# Altium schematic sheet Heater_conn.SchDoc
size A4; SheetNumber: 7; SheetTotal: 7
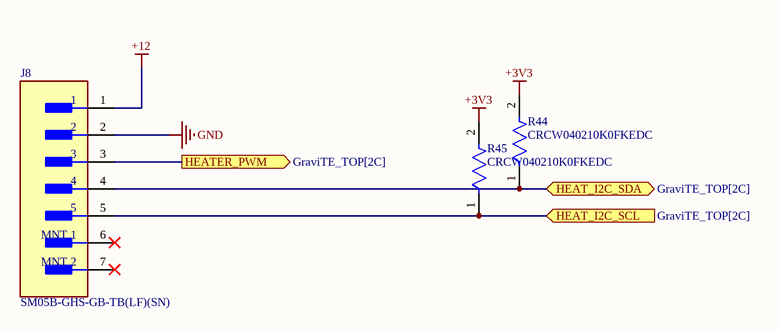
[diagram p0: Heater_conn.SchDoc]

## Parts
J8  SM05B-GHS-GB-TB(LF)(SN)  [FP-SM05B-GHS-GB-TB_LF_SN-MFG]
R44  CRCW040210K0FKEDC  [FP-CRCW0402-C-e3-IPC_C]
R45  CRCW040210K0FKEDC  [FP-CRCW0402-C-e3-IPC_C]

## Ports
HEAT_I2C_SCL (in, see GraviTE_TOP[2C]), HEAT_I2C_SDA (bidir, see GraviTE_TOP[2C]), HEATER_PWM (out, see GraviTE_TOP[2C])

## Nets
+3V3: R44.2 R45.2
+12: J8.1
GND: J8.2
HEAT_I2C_SCL: J8.5 R45.1 ; port HEAT_I2C_SCL
HEAT_I2C_SDA: J8.4 R44.1 ; port HEAT_I2C_SDA
HEATER_PWM: J8.3 ; port HEATER_PWM

Not connected (* = marked no-connect by the designer): J8 6(MNT_1)* 7(MNT_2)*

## Library data of the parts
J8 = CMP-17439-000484-1: Connector Header Surface Mount, Right Angle 5 position 0.049" (1.25mm)
R44 R45 = CMP-02407-012085-1: RES 10K OHM 1% 1/16W 0402; Temperature Coefficient: 100ppm/°C; Power Rating: 62.5mW; Resistance: 10kR; Lead Free: Lead Free; Max Operating Temperature: 155°C; RoHS Compliant: Yes; Mount: Surface Mount; Min Operating Temperature: -55°C; Termination: Wraparound; Length: 1mm; Resistor Type: Thick Film; Contact Plating: Tin; Tolerance: 1%; Case/Package: Molded